# Altium schematic sheet 74HC154 4-16 Decoder.SchDoc
size Letter
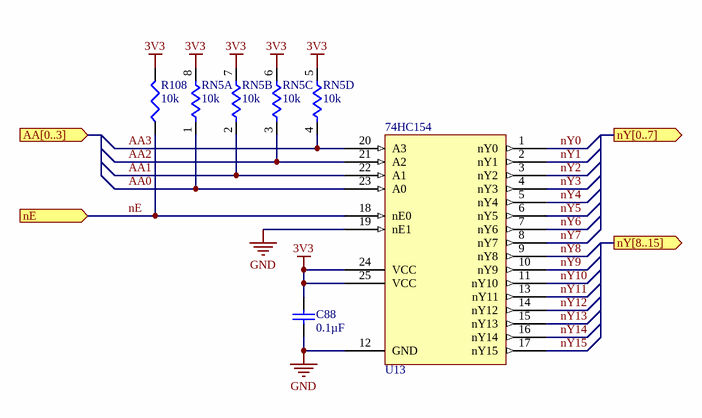
[diagram p0: 74HC154 4-16 Decoder.SchDoc]

## Parts
C88  value 0.1µF  [TDK-CGA2B]  (hidden comment: Cap)
R108  value 10k  [PANA-ERJ2R]  (hidden comment: Res3)
RN5  value 10k  [PANA-EXB28V]  (hidden comment: Res4 Pack1)  (parts A,B,C,D of 4)
U13  74HC154  [NEX-SOT815-1]

## Ports
AA[0..3] (in), nE (in), nY[0..7] (out), nY[8..15] (out)

## Nets
3V3: C88.2 R108.2 RN5.5 RN5.6 RN5.7 RN5.8 U13.24(VCC) U13.25(VCC)
GND: C88.1 U13.12(GND) U13.19(nE1)
AA0: RN5.1 U13.23(A0)
AA1: RN5.2 U13.22(A1)
AA2: RN5.3 U13.21(A2)
AA3: RN5.4 U13.20(A3)
nE: R108.1 U13.18(nE0) ; port nE
nY0: U13.1(nY0)
nY1: U13.2(nY1)
nY2: U13.3(nY2)
nY3: U13.4(nY3)
nY4: U13.5(nY4)
nY5: U13.6(nY5)
nY6: U13.7(nY6)
nY7: U13.8(nY7)
nY8: U13.9(nY8)
nY9: U13.10(nY9)
nY10: U13.11(nY10)
nY11: U13.13(nY11)
nY12: U13.14(nY12)
nY13: U13.15(nY13)
nY14: U13.16(nY14)
nY15: U13.17(nY15)

## Notes on the sheet
- (the "License"); you may not use or redistribute this file except in compliance with the License. You
- This file and the information within it are licensed under the terms of the Apache License, Version 2.0
- Copyright
- Unless required by applicable law or agreed to in writing, content distributed under the License is
- distributed on an "AS IS" BASIS, WITHOUT WARRANTIES OR CONDITIONS OF ANY KIND,
- either express or implied. See the License for the specific language governing permissions and
- limitations under the License.
- may obtain a copy of the License at:
- http://www.apache.org/licenses/LICENSE-2.0
- Title
- Size:
- Date:
- Letter
- Number:
- Time:
- Revision:
- Sheet
- of
- University of Alberta
- Deptartment of Electrical
- and Computer Engineering
- Edmonton AB, Canada
- T6G 1H9
- File:

## Library data of the parts
C88 = PC-TDK-02262: CAP CER 0.1UF 50V X7R 0402; Manufacturer Part Number: CGA2B3X7R1H104M050BB; Index: 2262; Designator: C?; Tolerance: ±20%; Published: 3/16/2016; LatestRevisionDate: 3/16/2016; LatestRevisionNote: ...; PackageReference: 0402 (1005 Metric); Publisher: AlbertaSat; PackageDescription: Radial Cap, Thru-Hole; 2 Leads; 0.3 in Pin Spacing; Part Number: PC-TDK-02262; Supplier Part Number 1: 445-12271-1-ND; Supplier 1: Digi-key; Supplier Link: http://www.digikey.ca/product-search/en?keywords=445-12271-1-ND; Voltage - Rated: 50V; Temperature Coefficient: X7R; Applications: Automotive
R108 = 17198: RES SMD 10K OHM 1% 1/10W 0402; Part Number: 17198; Manufacturer Part Number: ERJ-2RKF1002X; Designator: R?; Power: 0.1W, 1/10W; Temperature Coefficient: ±100ppm/°C; Published: 8-Jun-2000; LatestRevisionDate: 29-May-2009; LatestRevisionNote: IPC-7351 Footprint Added.; PackageReference: 0402 (1005 Metric); Publisher: Altium Limited; PackageDescription: Chip Resistor, 2-Leads, Body 1.00x0.50mm, IPC Low Density; Supplier Part Number 1: P10.0KLCT-ND; Supplier 1: Digi-Key; Supplier Link: http://www.digikey.ca/product-search/en?keywords=P10.0KLCT-ND; Tolerance: ±1%
RN5 = 19968: RES ARRAY 4 RES 10K OHM 0804; Part Number: 19968; Manufacturer Part Number: EXB-28V103JX; Sim Note: Enter the Resistance value into parameter field.; Designator: RN?; Tolerance: ±5%; Power: 62.5mW; Temperature Coefficient: ±200ppm/°C; Code_JEDEC: MS-012-AC; Supplier Part Number 1: Y7103CT-ND; Supplier 1: Digi-Key; Supplier Link: http://www.digikey.ca/product-search/en?keywords=Y7103CT-ND; PackageReference: 0804, Convex, Long Side Terminals
U13 = PU-NEX-00001: IC DECODER/DEMUX 4-16LN 24DHVQFN; Manufacturer Part Number: 74HC154BQ,118; Index: 1; Part Number: PU-NEX-00001; Supplier Part Number 1: 1727-6583-1-ND; Supplier 1: Digi-key; Supplier Part Number 2: 771-74HC154BQ,118; Supplier 2: Mouser; Publisher: AlbertaSat; Published: 2019-07-25; LatestRevisionDate: 2019-07-25; LatestRevisionNote: ...; PackageReference: 24-VFQFN Exposed Pad; PackageDescription: QFN, 24-Leads, Body 3.50x5.50mm, Pitch 1.50mm/0.50mm, Thermal Pad 2.10x4.10mm, IPC Low Density; Supplier Link: #https://www.digikey.ca/product-detail/en/nexperia-usa-inc/74HC154BQ118/1727-6583-1-ND/2813776#